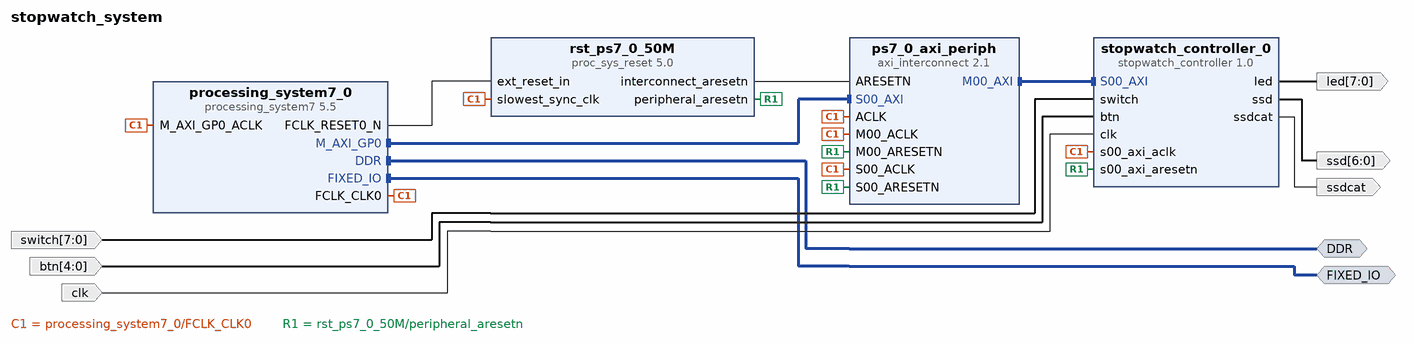
[diagram p0: block diagram of the top level]
# Vivado block design stopwatch_system, xc7z020clg484-1, Vivado 2016.3
create_bd_design stopwatch_system

create_bd_intf_port -mode Master -vlnv xilinx.com:interface:ddrx_rtl:1.0 DDR
create_bd_intf_port -mode Master -vlnv xilinx.com:display_processing_system7:fixedio_rtl:1.0 FIXED_IO
create_bd_port -dir I -from 7 -to 0 switch
create_bd_port -dir O -from 6 -to 0 ssd
create_bd_port -dir O -from 7 -to 0 led
create_bd_port -dir I -from 4 -to 0 btn
create_bd_port -dir O ssdcat
create_bd_port -dir I -type clk clk

create_bd_cell -type ip -vlnv xilinx.com:user:stopwatch_controller:1.0 stopwatch_controller_0
create_bd_cell -type ip -vlnv xilinx.com:ip:processing_system7:5.5 processing_system7_0
set_property -dict {CONFIG.preset ZedBoard} [get_bd_cells processing_system7_0]
create_bd_cell -type ip -vlnv xilinx.com:ip:axi_interconnect:2.1 ps7_0_axi_periph
set_property -dict {CONFIG.NUM_MI 1} [get_bd_cells ps7_0_axi_periph]
create_bd_cell -type ip -vlnv xilinx.com:ip:proc_sys_reset:5.0 rst_ps7_0_50M

# ---- connections ----

connect_bd_intf_net [get_bd_intf_pins processing_system7_0/M_AXI_GP0] [get_bd_intf_pins ps7_0_axi_periph/S00_AXI]
connect_bd_intf_net [get_bd_intf_pins ps7_0_axi_periph/M00_AXI] [get_bd_intf_pins stopwatch_controller_0/S00_AXI]
connect_bd_intf_net [get_bd_intf_ports DDR] [get_bd_intf_pins processing_system7_0/DDR]
connect_bd_intf_net [get_bd_intf_ports FIXED_IO] [get_bd_intf_pins processing_system7_0/FIXED_IO]
connect_bd_net [get_bd_pins processing_system7_0/FCLK_CLK0] \
  [get_bd_pins processing_system7_0/M_AXI_GP0_ACLK] [get_bd_pins ps7_0_axi_periph/S00_ACLK] \
  [get_bd_pins rst_ps7_0_50M/slowest_sync_clk] [get_bd_pins ps7_0_axi_periph/ACLK] \
  [get_bd_pins stopwatch_controller_0/s00_axi_aclk] [get_bd_pins ps7_0_axi_periph/M00_ACLK]
connect_bd_net [get_bd_pins processing_system7_0/FCLK_RESET0_N] [get_bd_pins rst_ps7_0_50M/ext_reset_in]
connect_bd_net [get_bd_pins rst_ps7_0_50M/peripheral_aresetn] \
  [get_bd_pins ps7_0_axi_periph/S00_ARESETN] [get_bd_pins stopwatch_controller_0/s00_axi_aresetn] \
  [get_bd_pins ps7_0_axi_periph/M00_ARESETN]
connect_bd_net [get_bd_pins rst_ps7_0_50M/interconnect_aresetn] [get_bd_pins ps7_0_axi_periph/ARESETN]
connect_bd_net [get_bd_ports switch] [get_bd_pins stopwatch_controller_0/switch]
connect_bd_net [get_bd_pins stopwatch_controller_0/ssd] [get_bd_ports ssd]
connect_bd_net [get_bd_pins stopwatch_controller_0/led] [get_bd_ports led]
connect_bd_net [get_bd_ports btn] [get_bd_pins stopwatch_controller_0/btn]
connect_bd_net [get_bd_pins stopwatch_controller_0/ssdcat] [get_bd_ports ssdcat]
connect_bd_net [get_bd_ports clk] [get_bd_pins stopwatch_controller_0/clk]

# ---- address map ----
assign_bd_address -offset 0x43C00000 -range 64K -target_address_space [get_bd_addr_spaces processing_system7_0/Data] [get_bd_addr_segs stopwatch_controller_0/S00_AXI/S00_AXI_reg]

validate_bd_design
save_bd_design
